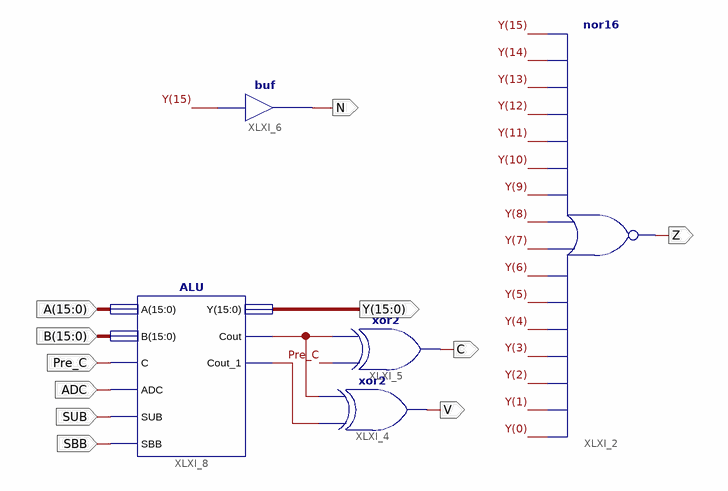
[diagram p0: schematic sheet 1]
// Xilinx ISE schematic comple_adder_16bit_CC.sch (virtex6) as structural Verilog: 5 symbols, 11 ports
module comple_adder_16bit_CC (
  input  [15:0] A,
  input  [15:0] B,
  input  Pre_C,
  input  ADC,
  input  SUB,
  input  SBB,
  output Z,
  output V,
  output [15:0] Y,
  output C,
  output N
);

  wire XLXN_25, XLXN_33;

  nor XLXI_2 (Z, Y[0], Y[1], Y[2], Y[3], Y[4], Y[5], Y[6], Y[7], Y[8], Y[9], Y[10], Y[11], Y[12], Y[13], Y[14], Y[15]);
  xor XLXI_4 (V, XLXN_25, XLXN_33);
  xor XLXI_5 (C, Pre_C, XLXN_33);
  buf XLXI_6 (N, Y[15]);
  ALU XLXI_8 (.A(A), .B(B), .C(Pre_C), .ADC(ADC), .SUB(SUB), .SBB(SBB), .Y(Y), .Cout(XLXN_33), .Cout_1(XLXN_25));
endmodule
